# Altium schematic sheet Sheet1_MB.SchDoc
size A3; SheetNumber: 1; SheetTotal: 1
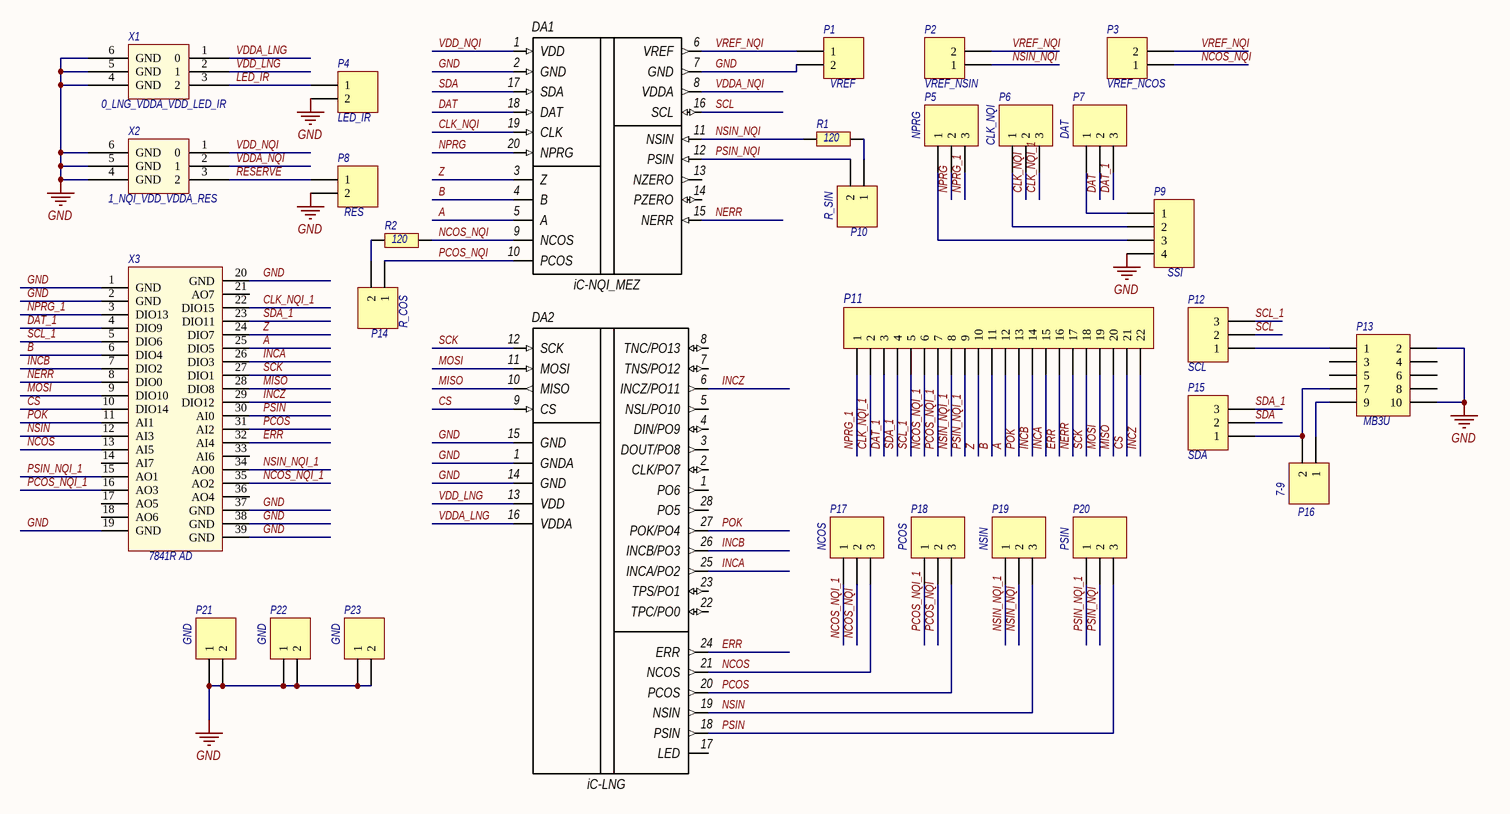
[diagram p0: Sheet1_MB.SchDoc]

## Parts
DA1  iC-NQI_MEZ  [iC-NQI_MEZ]
DA2  iC-LNG  [iC_LNG_MEZON]
P1  VREF  [HDR1X2]
P2  VREF_NSIN  [HDR1X2]
P3  VREF_NCOS  [HDR1X2]
P4  LED_IR  [HDR1X2]
P5  NPRG  [HDR1X3]
P6  CLK_NQI  [HDR1X3]
P7  DAT  [HDR1X3]
P8  RES  [HDR1X2]
P9  SSI  [HDR1X4]
P10  R_SIN  [HDR1X2]
P11  Header 22  [HDR1X22]  (value not drawn)
P12  SCL  [HDR1X3]
P13  MB3U  [HDR2X5]
P14  R_COS  [HDR1X2]
P15  SDA  [HDR1X3]
P16  7-9  [HDR1X2]
P17  NCOS  [HDR1X3]
P18  PCOS  [HDR1X3]
P19  NSIN  [HDR1X3]
P20  PSIN  [HDR1X3]
P21  GND  [HDR1X2]
P22  GND  [HDR1X2]
P23  GND  [HDR1X2]
R1  120  [RES]
R2  120  [RES]
X1  0_LNG_VDDA_VDD_LED_IR  [POWER]
X2  1_NQI_VDD_VDDA_RES  [POWER]
X3  7841R AD  [CHEAP_CONN_FEMALE]

## Nets
GND: DA1.2(GND) DA1.7(GND) DA2.1(PO6) DA2.14(GND) DA2.15(GND) P1.2 P4.2 P8.2 P9.4 P13.2 P13.10 P21.1 P21.2 P22.1 P22.2 P23.1 P23.2 X1.4(GND) X1.5(GND) X1.6(GND) X2.4(GND) X2.5(GND) X2.6(GND) X3.1(GND) X3.2(GND) X3.19(GND) X3.20(GND) X3.37(GND) X3.38(GND) X3.39(GND)
A: DA1.5(A) P11.12 X3.25(DIO5)
B: DA1.4(B) P11.11 X3.6(DIO4)
CLK_NQI: DA1.19(CLK) P6.2
CLK_NQI_1: P6.3 P11.2 X3.22(DIO15)
CS: DA2.9(CS) P11.21 X3.10(DIO14)
DAT: DA1.18(DAT) P7.2
DAT_1: P7.3 P11.3 X3.4(DIO9)
ERR: DA2.24(ERR) P11.16 X3.32(AI4)
INCA: DA2.25(INCA/PO2) P11.15 X3.26(DIO3)
INCB: DA2.26(INCB/PO3) P11.14 X3.7(DIO2)
INCZ: DA2.6(INCZ/PO11) P11.22 X3.29(DIO12)
LED_IR: P4.1 X1.3(2)
MISO: DA2.10(MISO) P11.20 X3.28(DIO8)
MOSI: DA2.11(MOSI) P11.19 X3.9(DIO10)
NCOS: DA2.21(NCOS) P17.3 X3.13(AI5)
NCOS_NQI: DA1.9(NCOS) P3.1 P17.2 R2.1
NCOS_NQI_1: P11.6 P17.1 X3.35(AO2)
NERR: DA1.15(NERR) P11.17 X3.8(DIO0)
NPRG: DA1.20(NPRG) P5.2
NPRG_1: P5.3 P11.1 X3.3(DIO13)
NSIN: DA2.19(NSIN) P19.3 X3.12(AI3)
NSIN_NQI: DA1.11(NSIN) P2.1 P19.2 R1.2
NSIN_NQI_1: P11.8 P19.1 X3.34(AO0)
PCOS: DA2.20(PCOS) P18.3 X3.31(AI2)
PCOS_NQI: DA1.10(PCOS) P14.1 P18.2
PCOS_NQI_1: P11.7 P18.1 X3.16(AO3)
POK: DA2.27(POK/PO4) P11.13 X3.11(AI1)
PSIN: DA2.18(PSIN) P20.3 X3.30(AI0)
PSIN_NQI: DA1.12(PSIN) P10.2 P20.2
PSIN_NQI_1: P11.9 P20.1 X3.15(AO1)
RESERVE: P8.1 X2.3(2)
SCK: DA2.12(SCK) P11.18 X3.27(DIO1)
SCL: DA1.16(SCL) P12.2
SCL_1: P11.5 P12.3 X3.5(DIO6)
SDA: DA1.17(SDA) P15.2
SDA_1: P11.4 P15.3 X3.23(DIO11)
VDD_LNG: DA2.13(VDD) X1.2(1)
VDD_NQI: DA1.1(VDD) X2.1(0)
VDDA_LNG: DA2.16(VDDA) X1.1(0)
VDDA_NQI: DA1.8(VDDA) X2.2(1)
VREF_NQI: DA1.6(VREF) P1.1 P2.2 P3.2
Z: DA1.3(Z) P11.10 X3.24(DIO7)
NetP5_1: P5.1 P9.3
NetP6_1: P6.1 P9.2
NetP7_1: P7.1 P9.1
NetP10_1: P10.1 R1.1
NetP12_1: P12.1 P13.1
NetP13_7: P13.7 P15.1 P16.2
NetP13_9: P13.9 P16.1
NetP14_2: P14.2 R2.2

Not connected (* = marked no-connect by the designer): DA1 13(NZERO) 14(PZERO); DA2 2(CLK/PO7) 3(DOUT/PO8) 4(DIN/PO9) 5(NSL/PO10) 7(TNS/PO12) 8(TNC/PO13) 17(LED) 22(TPC/PO0) 23(TPS/PO1) 28(PO5); P13 3 4 5 6 8; X3 14(AI7) 17(AO5) 18(AO6) 21(AO7) 33(AI6) 36(AO4)

## Library data of the parts
DA1 = iC-NQI_MEZ: Оптический энкодер
DA2 = iC-LNG_MEZ: Оптический энкодер
P1-P4 P8 P10 P14 P16 P21-P23 = Header 2: Header, 2-Pin; LatestRevisionDate: 17-Jul-2002; LatestRevisionNote: Re-released for DXP Platform.; Publisher: Altium Limited
P5-P7 P12 P15 P17-P20 = Header 3: Header, 3-Pin; LatestRevisionDate: 17-Jul-2002; LatestRevisionNote: Re-released for DXP Platform.; Publisher: Altium Limited
P9 = Header 4: Header, 4-Pin; LatestRevisionDate: 17-Jul-2002; LatestRevisionNote: Re-released for DXP Platform.; Publisher: Altium Limited
P11 = Header 22: Header, 22-Pin; LatestRevisionDate: 17-Jul-2002; LatestRevisionNote: Re-released for DXP Platform.; Publisher: Altium Limited
P13 = Header 5X2: Header, 5-Pin, Dual row; LatestRevisionDate: 17-Jul-2002; LatestRevisionNote: Re-released for DXP Platform.; Publisher: Altium Limited
R1 R2 = RES
X1 X2 = POWER
X3 = CHEAP_CON_37_FEM_7841R_AD